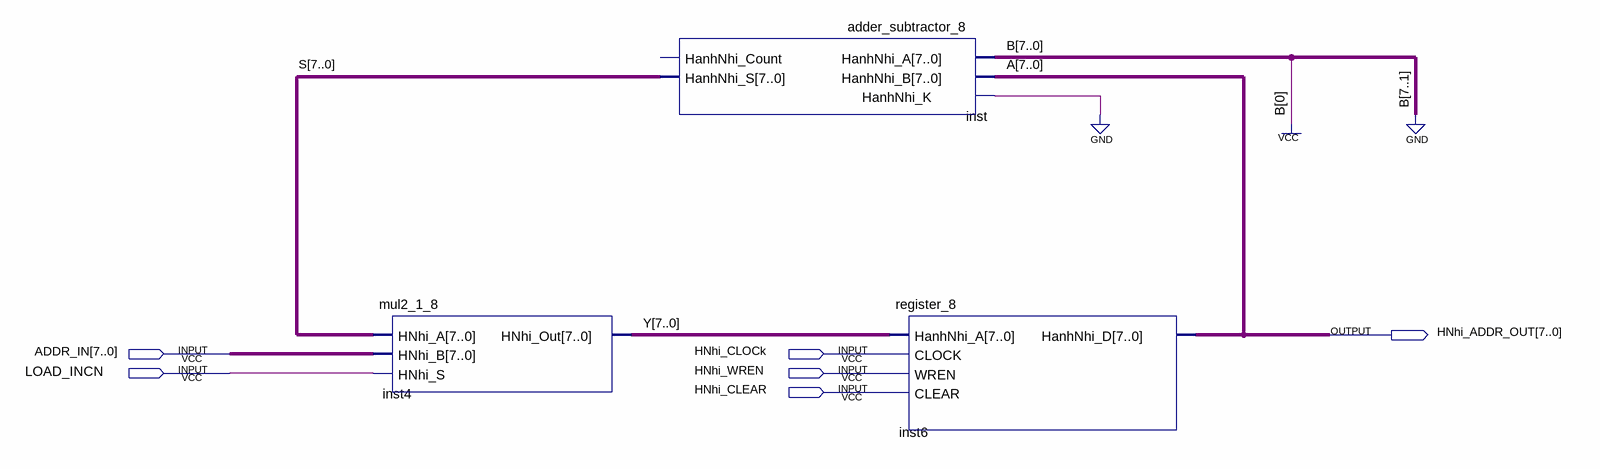
[diagram p0: schematic sheet]
// Quartus schematic Assignment2.bdf as structural Verilog: 3 symbols, 6 pins
module Assignment2 (
  input  [7:0] ADDR_IN,
  input  HNhi_CLOCk,
  input  LOAD_INCN,
  input  HNhi_WREN,
  input  HNhi_CLEAR,
  output [7:0] HNhi_ADDR_OUT
);

  wire [7:0] S, Y;

  mul2_1_8 inst4 (.HNhi_A(S), .HNhi_B(ADDR_IN), .HNhi_S(LOAD_INCN), .HNhi_Out(Y));
  adder_subtractor_8 inst (
    .HanhNhi_A(8'b00000001), .HanhNhi_B(HNhi_ADDR_OUT), .HanhNhi_K(1'b0), .HanhNhi_S(S));  // open: HanhNhi_Count
  register_8 inst6 (.HanhNhi_A(Y), .CLOCK(HNhi_CLOCk), .WREN(HNhi_WREN), .CLEAR(HNhi_CLEAR), .HanhNhi_D(HNhi_ADDR_OUT));

  // Other names for the same wires on the sheet: A[7:0] = HNhi_ADDR_OUT
endmodule
